# Altium schematic sheet ETA9640.SchDoc
size A4
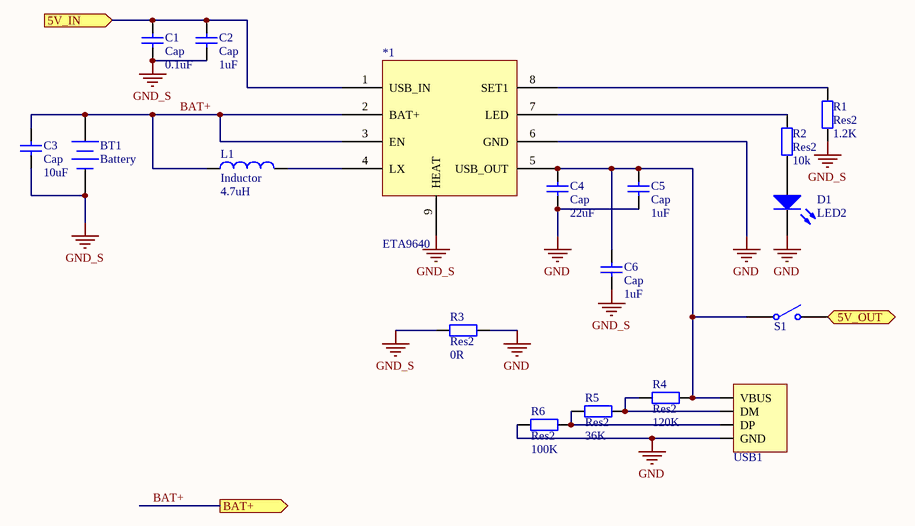
[diagram p0: ETA9640.SchDoc]

## Parts
*1  ETA9640  [ESOP-8]
BT1  Battery  [BAT-2]
C1  Cap  value 0.1uF  [CAP_0603]
C2  Cap  value 1uF  [CAP_0603]
C3  Cap  value 10uF  [1206]
C4  Cap  value 22uF  [1206]
C5  Cap  value 1uF  [CAP_0603]
C6  Cap  value 1uF  [CAP_0603]
D1  LED2  [LED_0603_RED]
L1  Inductor  value 4.7uH  [VLF4012_2R2]
R1  Res2  value 1.2K  [RES_0603]
R2  Res2  value 10k  [RES_0603]
R3  Res2  value 0R  [RES_0603]
R4  Res2  value 120K  [RES_0603]
R5  Res2  value 36K  [RES_0603]
R6  Res2  value 100K  [RES_0603]
S1  SW-SPST  [SB-4]  (value not drawn)
USB1  USB  [USB]  (value not drawn)

## Ports
5V_IN (in), 5V_OUT (out), BAT+ (out)

## Nets
GND: *1.6(GND) C4.1 C5.1 D1.2(K) R3.1 R6.1 USB1.-(GND)
GND_S: *1.9(HEAT) BT1.2(-) C1.1 C2.1 C3.1 C6.1 R1.1 R3.2
5V_IN: *1.1(USB_IN) C1.2 C2.2 ; port 5V_IN
5V_OUT: S1.2(NO) ; port 5V_OUT
BAT+: *1.2(BAT+) *1.3(EN) BT1.1(+) C3.2 L1.1 ; port BAT+
Net*1_4: *1.4(LX) L1.2
Net*1_5: *1.5(USB_OUT) C4.2 C5.2 C6.2 R4.2 S1.1(COMMON) USB1.+(VBUS)
Net*1_7: *1.7(LED) R2.2
Net*1_8: *1.8(SET1) R1.2
NetD1_1: D1.1(A) R2.1
NetR4_1: R4.1 R5.2 USB1.DM
NetR5_1: R5.1 R6.2 USB1.DP

## Library data of the parts
BT1 = Battery: Multicell Battery; Published: 24-Mar-1999; LatestRevisionDate: 17-Jul-2002; LatestRevisionNote: Re-released for DXP Platform.; PackageReference: BAT-2; Publisher: Altium Limited
C1-C6 = Cap: Capacitor; Published: 8-Jun-2000; LatestRevisionDate: 17-Jul-2002; LatestRevisionNote: Re-released for DXP Platform.; PackageReference: RAD-0.3; Publisher: Altium Limited; PackageDescription: Radial Cap, Thru-Hole; 2 Leads; 0.3 in Pin Spacing
D1 = LED2: Typical RED, GREEN, YELLOW, AMBER GaAs LED; Published: 8-Jun-2000; LatestRevisionDate: 17-Jul-2002; LatestRevisionNote: Re-released for DXP Platform.; PackageVersion: Feb-2002; PackageReference: 3.2X1.6X1.1; Publisher: Altium Limited; PackageDescription: SM LED; 2 Flat Leads
L1 = Inductor: Code_IEC: 1005; Published: 8-Jun-2000; LatestRevisionDate: 29-May-2009; LatestRevisionNote: IPC-7351 Footprint Added.; PackageReference: 0402-A; Publisher: Altium Limited; PackageDescription: Chip Inductor; Code_JEITA: 0402
R1-R6 = Res2: Resistor; Published: 8-Jun-2000; LatestRevisionDate: 17-Jul-2002; LatestRevisionNote: Re-released for DXP Platform.; PackageReference: AXIAL-0.4; Publisher: Altium Limited; PackageDescription: Axial Device, Thru-Hole; 2 Leads; 0.4 in Pin Spacing
S1 = SW-SPST: Single-Pole, Single-Throw Switch; Published: 24-Mar-1999; LatestRevisionDate: 17-Jul-2002; LatestRevisionNote: Re-released for DXP Platform.; PackageReference: SPST-2; Publisher: Altium Limited